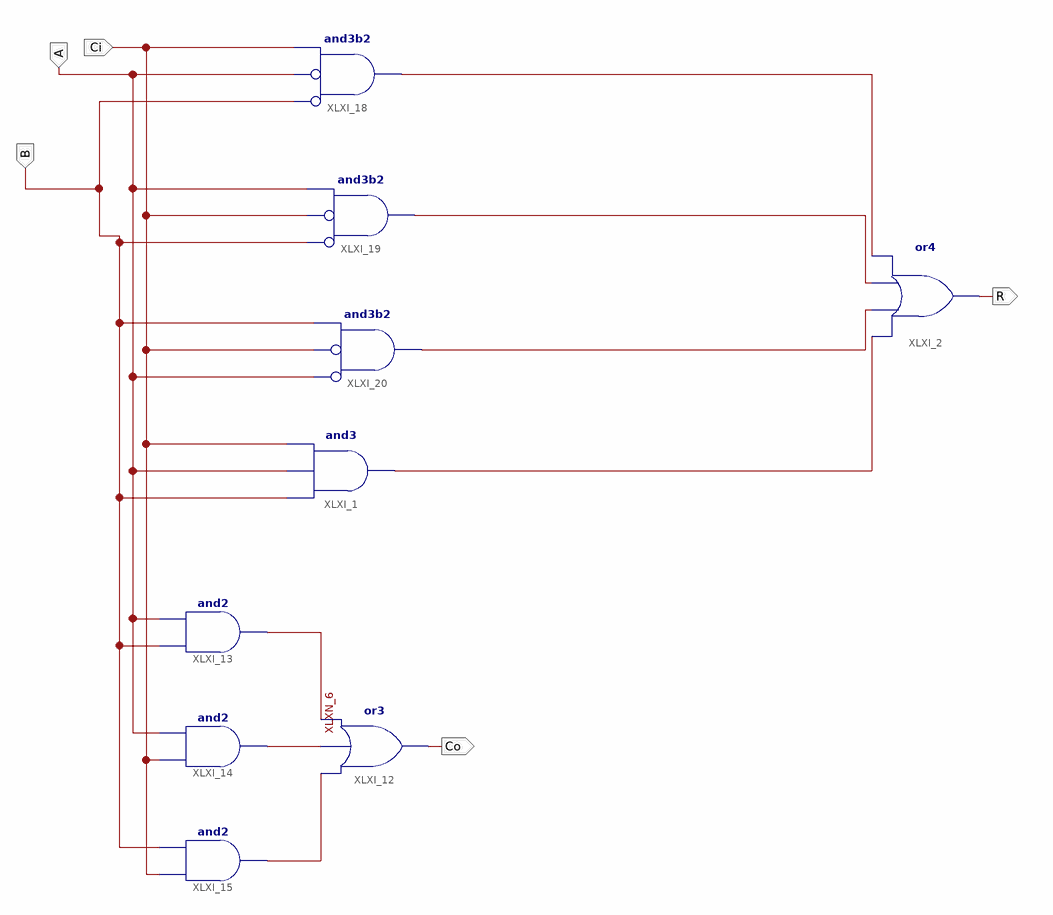
[diagram p0: schematic sheet 1]
// Xilinx ISE schematic Add1b.sch (spartan3e) as structural Verilog: 9 symbols, 5 ports
module Add1b (
  input  Ci,
  input  B,
  input  A,
  output R,
  output Co
);

  wire XLXN_1, XLXN_2, XLXN_3, XLXN_6, XLXN_13, XLXN_27, XLXN_28;

  and XLXI_1 (XLXN_3, B, A, Ci);
  or XLXI_2 (R, XLXN_3, XLXN_13, XLXN_2, XLXN_1);
  or XLXI_12 (Co, XLXN_28, XLXN_27, XLXN_6);
  and XLXI_13 (XLXN_6, B, A);
  and XLXI_14 (XLXN_27, Ci, A);
  and XLXI_15 (XLXN_28, Ci, B);
  and XLXI_18 (XLXN_1, ~B, ~A, Ci);  // and3b2
  and XLXI_19 (XLXN_2, ~B, ~Ci, A);  // and3b2
  and XLXI_20 (XLXN_13, ~A, ~Ci, B);  // and3b2
endmodule
